# EAGLE design LAB-PLR1010 (EAGLE 6.5.0)
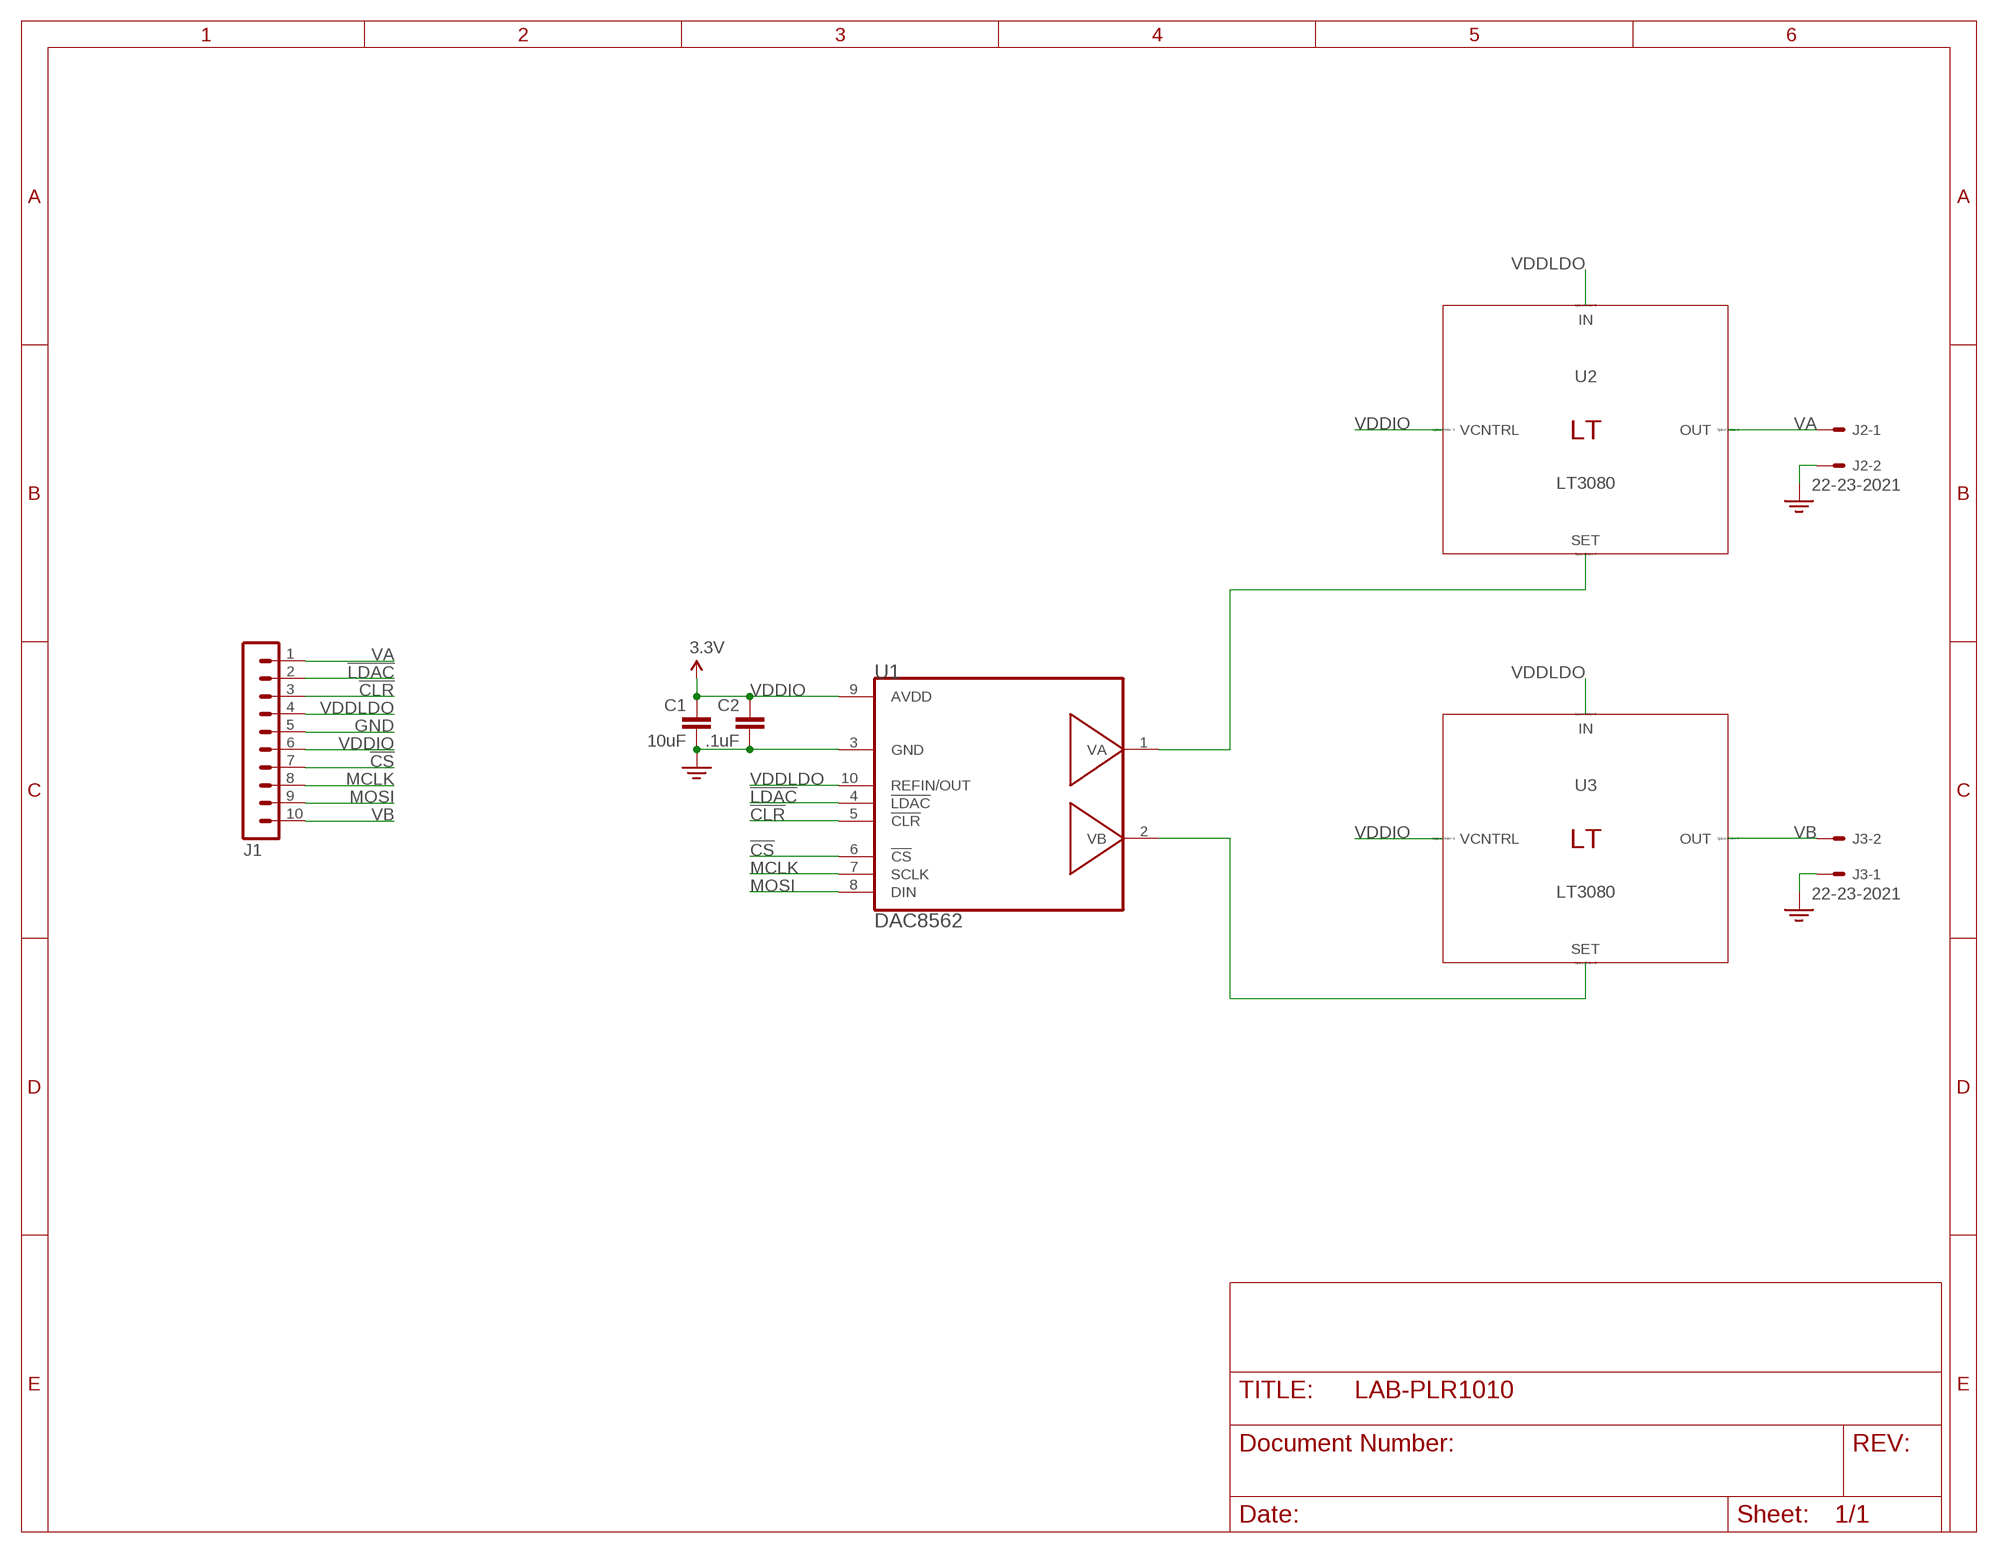
[diagram p0: schematic, sheet 1]

## Parts
C1  10uF  1NF/1000PF-50V-10%(0603)  [0603-CAP]
C2  .1uF  1NF/1000PF-50V-10%(0603)  [0603-CAP]
J1  MA10-1W  [MA10-1W]
J2  22-23-2021  [22-23-2021]
J3  22-23-2021  [22-23-2021]
U1  DAC8562  [MSOP10]
U2  LT3080  [DDPAK5(Q)]
U3  LT3080  [DDPAK5(Q)]

## Nets
!CLR: J1.3 U1.5(!CLR)
!CS: J1.7 U1.6(!CS)
!LDAC: J1.2 U1.4(!LDAC)
GND: C1.2 C2.2 J1.5 J2.2 J3.1 U1.3(GND) ; supply symbol labelled gnd
MCLK: J1.8 U1.7(SCLK)
MOSI: J1.9 U1.8(DIN)
N$2: U1.1(VA) U2.2(SET)
N$3: U1.2(VB) U3.2(SET)
VA: J1.1 J2.1 U2.3(OUT) U2.TAB(OUT)
VB: J1.10 J3.2 U3.3(OUT) U3.TAB(OUT)
VDDIO: C1.1 C2.1 J1.6 U1.9(AVDD) U2.4(VCNTRL) U3.4(VCNTRL) ; supply symbol labelled 3.3V
VDDLDO: J1.4 U1.10(REFIN/OUT) U2.5(IN) U3.5(IN)

## Library data of the parts
C1 C2 = SparkFun-Capacitors:1NF/1000PF-50V-10%(0603): CAP-07886; PROD_ID: CAP-07886; VALUE: 1nF
J1 = con-lstb:MA10-1W: PIN HEADER; OC_FARNELL: unknown; OC_NEWARK: unknown
J2 J3 = My Library-adm:22-23-2021: .100" (2.54mm) Center Header - 2 Pin
U1 = LAB-PLR1010:DAC8562
U2 U3 = LAB-PLR1010:LT3080: LT-Spice library generated with : ltspice.ulp from: E:/Programme/LTC/LTspiceIV/lib/sym/PowerProducts/LT3082*.asy at 05.10.2012 11:08:40; SPICEMODEL: LT1762.lib; SPICEPREFIX: X; VALUE2: LT1762

## Board
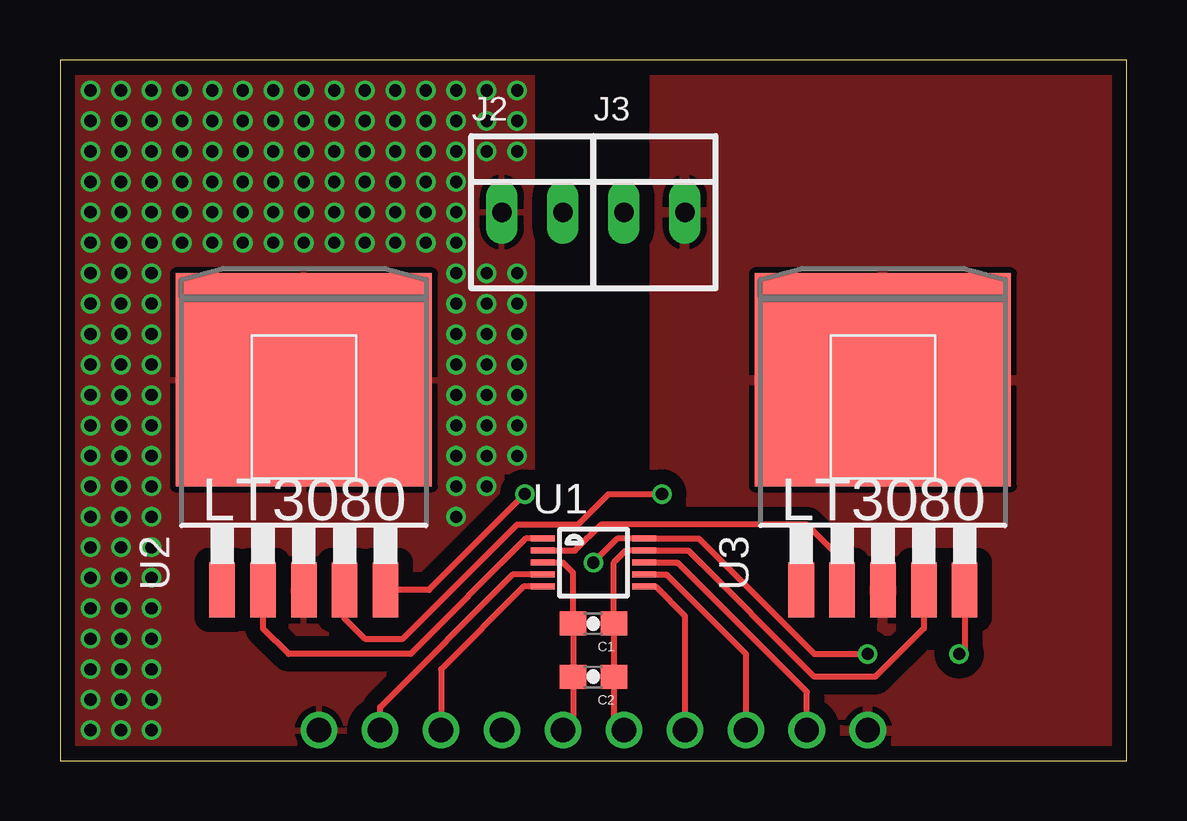
[diagram p1: board, top side]
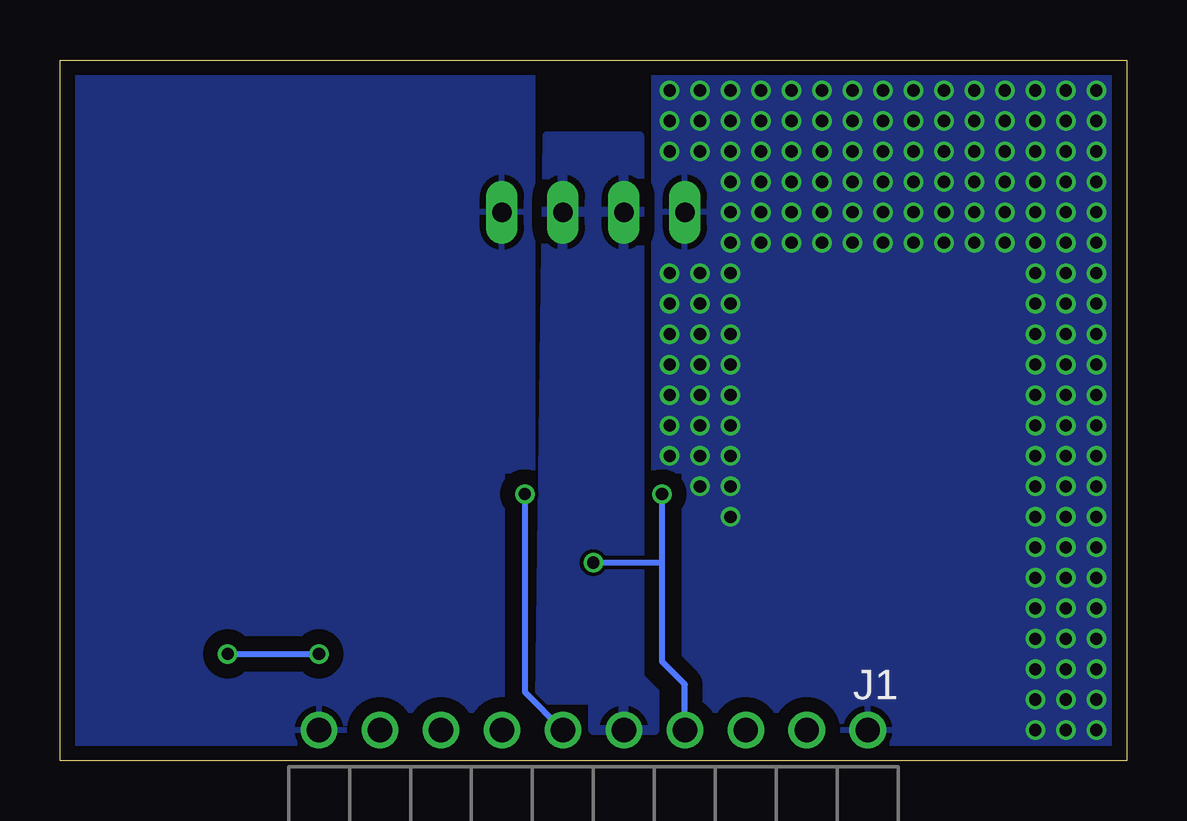
[diagram p2: board, bottom side, seen from below]

Size 44.45 x 29.21 mm. Coordinates in mm from the lower left corner, seen from the top.
Outline: 0,0 44.45,0 44.45,29.21 0,29.21 0,0
Copper layers (1*16): Top 0.035mm / dielectric 1.5mm / Bottom 0.035mm
Design rules "SeeedStudio_2layer_DRU_no_angle_20140221": minimum track width 6mil, minimum drill 12mil, track to track 6mil, track to pad 6mil, pad to pad 6mil, via to via 6mil, smd to smd 0mil, copper to edge 10mil, drill to drill 10mil, minimum pad ring 10mil, minimum via ring 6mil, stop-mask expansion 2mil, vias tented up to drill 100mil, thermal gap 10mil

### Footprints (pad centres in the part's own frame; a part is rotated, then mirrored left to right if it is on the bottom)
0603-CAP = smd 1.1 x 1: 1 -0.85,0; 2 0.85,0
MA10-1W = drill 1.016: 1 -11.43,0; 2 -8.89,0; 3 -6.35,0; 4 -3.81,0; 5 -1.27,0; 6 1.27,0; 7 3.81,0; 8 6.35,0; 9 8.89,0; 10 11.43,0
22-23-2021 = drill 0.813 long: 1 -1.27,0; 2 1.27,0
MSOP10 = smd 0.25 x 1: 1 -1,-2.113; 2 -0.5,-2.113; 3 0,-2.113; 4 0.5,-2.113; 5 1,-2.113; 6 1,2.113; 7 0.5,2.113; 8 0,2.113; 9 -0.5,2.113; 10 -1,2.113
DDPAK5(Q) = smd 1.067 x 2.286: 1 -3.404,-8.763; 2 -1.702,-8.763; 3 0,-8.763; 4 1.702,-8.763; 5 3.404,-8.763 | smd 10.668 x 8.89: TAB 0,0

### Placement (x,y rotation side)
C1  22.23,5.71 180 top
C2  22.23,3.49 180 top
J1  22.23,1.27 180 bottom
J2  19.69,22.86 0 top
J3  24.77,22.86 0 top
U1  22.23,8.26 270 top
U2  10.16,15.88 0 top
U3  34.29,15.88 0 top

### Tracks (layer width: path | path; a pad name or v marks a point on that pad's centre or on a via)
!CLR
  Top 0.254: J1.3 15.88,3.81 19.32,7.26 U1.5
!CS
  Top 0.254: J1.7 26.04,6.03 24.81,7.26 U1.6
!LDAC
  Top 0.254: J1.2 13.34,2.22 18.87,7.76 U1.4
GND
  Top 0.254: U1.3 20.96,8.26 21.38,7.83 C1.2 C2.2 21.38,1.69 J1.5
  pour Bottom: 20.32,26.04 20.32,3.49 19.69,2.86 19.69,1.27 22.23,1.27 22.23,2.54 24.45,2.54 24.13,26.04
MCLK
  Top 0.254: J1.8 28.58,4.45 25.27,7.76 U1.7
MOSI
  Top 0.254: J1.9 31.12,2.86 25.72,8.26 U1.8
N$2
  Top 0.254: U2.2 8.46,5.51 9.53,4.45 14.61,4.45 19.42,9.26 U1.1
N$3
  Top 0.254: U1.2 21.46,8.76 22.54,9.84 31.12,9.84 32.59,8.37 U3.2
VA  (via drill 0.51)
  other vias: 1.27,27.94 2.54,27.94 3.81,27.94 5.08,27.94 6.35,27.94 1.27,26.67 2.54,26.67 3.81,26.67 5.08,26.67 6.35,26.67 1.27,25.4 2.54,25.4 3.81,25.4 5.08,25.4 6.35,25.4 1.27,24.13 1.27,22.86 1.27,21.59 1.27,20.32 1.27,19.05 1.27,17.78 1.27,16.51 1.27,15.24 1.27,13.97 1.27,12.7 1.27,11.43 1.27,10.16 1.27,8.89 1.27,7.62 1.27,6.35 1.27,5.08 1.27,3.81 1.27,2.54 1.27,1.27 2.54,1.27 3.81,1.27 3.81,2.54 2.54,2.54 2.54,3.81 2.54,5.08 2.54,6.35 2.54,7.62 2.54,8.89 2.54,10.16 2.54,11.43 2.54,12.7 2.54,13.97 2.54,15.24 2.54,16.51 2.54,17.78 2.54,19.05 2.54,20.32 2.54,21.59 2.54,22.86 2.54,24.13 3.81,24.13 5.08,24.13 6.35,24.13 6.35,22.86 5.08,22.86 3.81,22.86 3.81,21.59 5.08,21.59 6.35,21.59 3.81,20.32 3.81,19.05 3.81,17.78 3.81,16.51 3.81,15.24 3.81,13.97 3.81,12.7 3.81,11.43 3.81,10.16 3.81,8.89 3.81,7.62 3.81,6.35 3.81,5.08 3.81,3.81 7.62,27.94 8.89,27.94 10.16,27.94 11.43,27.94 12.7,27.94 7.62,22.86 8.89,22.86 10.16,22.86 11.43,22.86 7.62,21.59 8.89,21.59 10.16,21.59 11.43,21.59 12.7,21.59 7.62,26.67 7.62,25.4 7.62,24.13 8.89,26.67 10.16,26.67 11.43,26.67 12.7,26.67 13.97,26.67 13.97,27.94 15.24,27.94 16.51,27.94 15.24,26.67 16.51,26.67 16.51,25.4 15.24,25.4 13.97,25.4 12.7,25.4 11.43,25.4 10.16,25.4 8.89,25.4 8.89,24.13 10.16,24.13 11.43,24.13 13.97,24.13 15.24,24.13 16.51,24.13 12.7,24.13 12.7,22.86 13.97,22.86 15.24,22.86 16.51,22.86 16.51,21.59 15.24,21.59 13.97,21.59 17.78,27.94 19.05,27.94 19.05,26.67 17.78,26.67 16.51,20.32 17.78,20.32 19.05,20.32 19.05,19.05 17.78,19.05 16.51,19.05 16.51,17.78 17.78,17.78 19.05,17.78 19.05,16.51 17.78,16.51 16.51,16.51 16.51,15.24 17.78,15.24 19.05,15.24 19.05,13.97 17.78,13.97 16.51,13.97 16.51,12.7 17.78,12.7 19.05,12.7 17.78,11.43 16.51,11.43 16.51,10.16 17.78,25.4 19.05,25.4
  pour Top (isolate 0.61): 0,0 18.42,0 18.42,12.07 19.69,12.07 19.69,29.21 0,29.21
  pour Bottom (isolate 0.61): 18.42,0 18.42,12.07 19.69,12.07 19.69,29.21 0,29.21 0,0
VB
  pour Top (isolate 0.61): 44.45,0 44.45,29.21 24.77,29.21 24.77,12.07 26.04,12.07 26.04,0
  pour Bottom (isolate 0.61): 26.04,0 44.45,0 44.45,29.21 24.77,29.21 24.77,12.07 26.04,12.07
VDDIO  (via drill 0.51)
  Top 0.254: U2.4 11.86,5.92 12.7,5.08 14.29,5.08 19.05,9.84 21.59,9.84 22.86,11.11 v25.08,11.11 | U3.4 35.99,5.51 33.97,3.49 31.43,3.49 26.17,8.76 U1.9 23.58,8.76 23.08,8.26 C1.1 C2.1 23.08,1.69 J1.6
  Bottom 0.254: v25.08,11.11 25.08,2.86 J1.6
VDDLDO  (via drill 0.51)
  Top 0.254: v33.66,4.45 31.43,4.45 26.62,9.26 U1.10 23.23,9.26 v22.23,8.26 | U3.5 37.69,4.67 v37.47,4.45 | v19.37,11.11 15.37,7.11 U2.5
  Bottom 0.254: v19.37,11.11 19.37,8.26 | 19.37,8.26 19.37,4.13 18.42,3.18 J1.4 | v37.47,4.45 v33.66,4.45 | v22.23,8.26 19.37,8.26